# Altium schematic sheet Arduino_extension_connectors.SchDoc: Connectors
size A4; CompanyName: STMicroelectronics; Organization: Microcontrollers Division; SheetNumber: 5; SheetTotal: 8
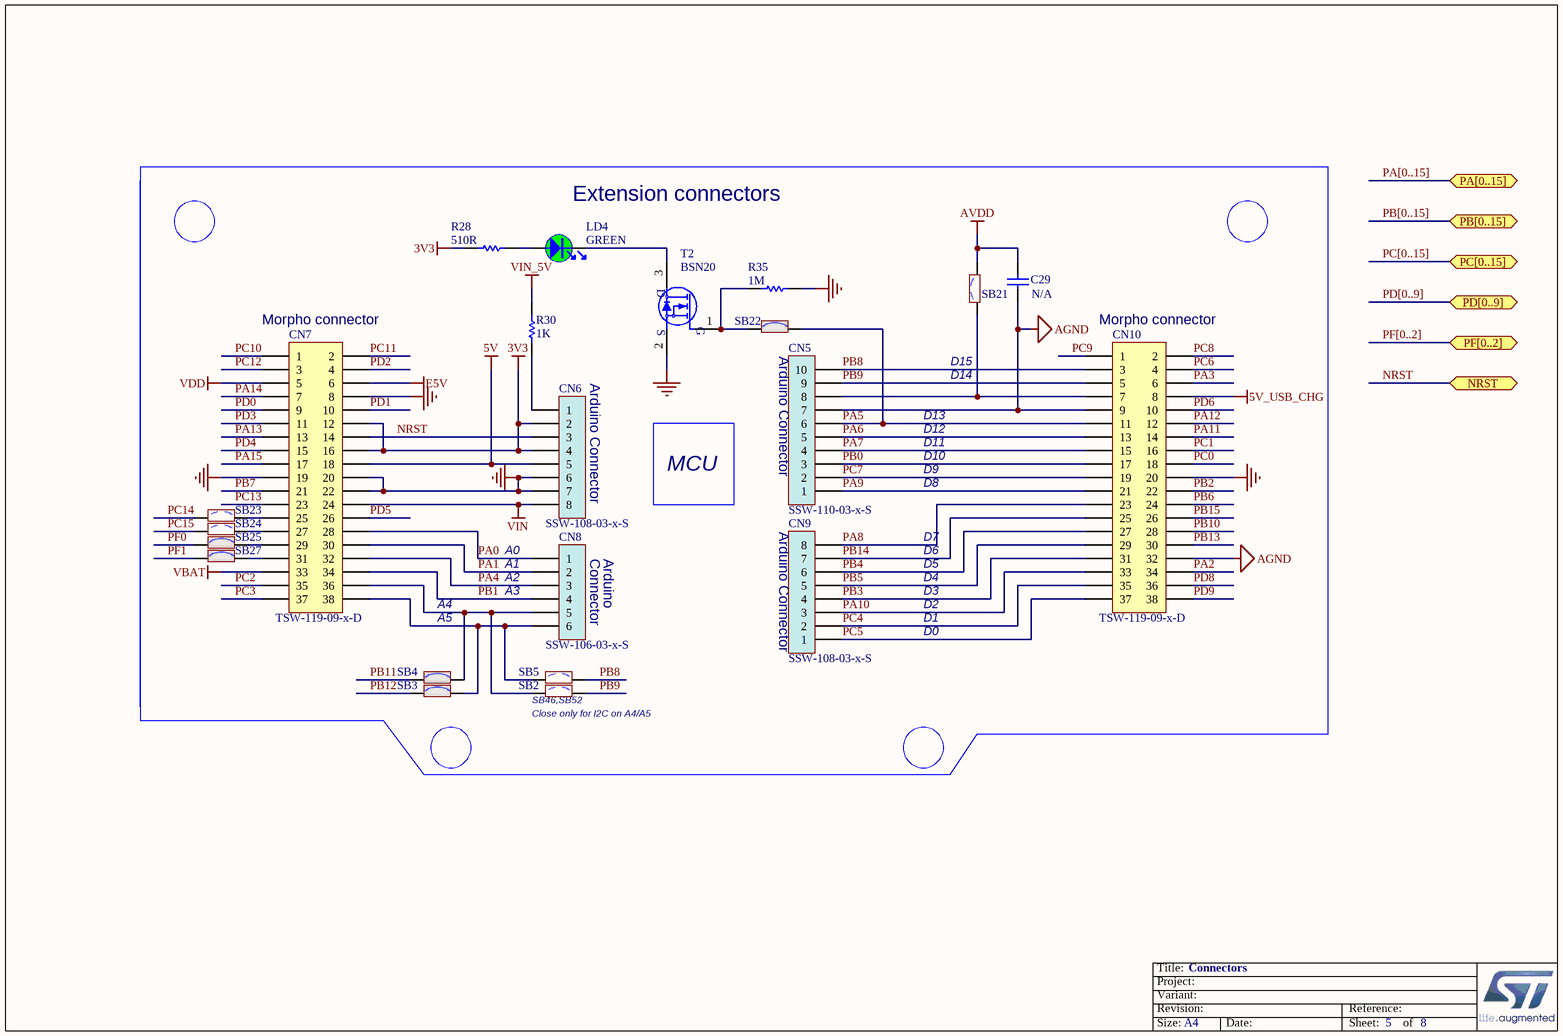
[diagram p0: Arduino_extension_connectors.SchDoc]

## Parts
C29  N/A  [C0603]
CN5  Manufacturer_Part_Number: SSW-110-03-x-S  [CON_SAMTEC_SSW-110-03-X-S]  (hidden comment: Socket 10x1)
CN6  Manufacturer_Part_Number: SSW-108-03-x-S  [CON_SAMTEC_SSW-108-03-X-S]  (hidden comment: Socket 8x1)
CN7  Manufacturer_Part_Number: TSW-119-09-x-D  [CON_SAMTEC_TSW-119-09-X-D]  (hidden comment: Header 19x2)
CN8  Manufacturer_Part_Number: SSW-106-03-x-S  [CON_SAMTEC_SSW-106-03-X-S]  (hidden comment: Socket 6x1)
CN9  Manufacturer_Part_Number: SSW-108-03-x-S  [CON_SAMTEC_SSW-108-03-X-S]  (hidden comment: Socket 8x1)
CN10  Manufacturer_Part_Number: TSW-119-09-x-D  [CON_SAMTEC_TSW-119-09-X-D]  (hidden comment: Header 19x2)
LD4  value GREEN  [LED_0603_GREEN]  (hidden comment: LED_green)
R28  value 510R  [R0603]  (hidden comment: Resistor)
R30  value 1K  [R0603]  (hidden comment: Resistor)
R35  value 1M  [R0603]  (hidden comment: Resistor)
SB2  SB_OFF  [SOLDER-BRIDGE_R0603-0R]  (value not drawn)
SB3  SB_ON  [SOLDER-BRIDGE_R0603-0R]  (value not drawn)
SB4  SB_ON  [SOLDER-BRIDGE_R0603-0R]  (value not drawn)
SB5  SB_OFF  [SOLDER-BRIDGE_R0603-0R]  (value not drawn)
SB21  SB_OFF  [SOLDER-BRIDGE_R0603-0R]  (value not drawn)
SB22  SB_ON  [SOLDER-BRIDGE_R0603-0R]  (value not drawn)
SB23  SB_OFF  [SOLDER-BRIDGE_R0603-0R]  (value not drawn)
SB24  SB_OFF  [SOLDER-BRIDGE_R0603-0R]  (value not drawn)
SB25  SB_ON  [SOLDER-BRIDGE_R0603-0R]  (value not drawn)
SB27  SB_ON  [SOLDER-BRIDGE_R0603-0R]  (value not drawn)
T2  BSN20  [MOS_SOT23]

## Ports
NRST, PA[0..15] (bidir), PB[0..15] (bidir), PC[0..15] (bidir), PD[0..9], PF[0..2] (bidir)

## Nets
3V3: CN6.2 CN6.4 CN7.12 CN7.16 R28.2
5V: CN6.5 CN7.18
5V_USB_CHG: CN10.8
AGND: C29.1 CN5.7 CN10.9 CN10.32
AVDD: C29.2 SB21.2
E5V: CN7.6
GND: CN6.6 CN6.7 CN7.8 CN7.19 CN7.20 CN7.22 CN10.20 R35.2 T2.2(S)
VBAT: CN7.33
VDD: CN7.5
VIN: CN6.8 CN7.24
VIN_5V: R30.1
NRST: CN6.3 CN7.14 ; port NRST
PA0: CN7.28 CN8.1
PA1: CN7.30 CN8.2
PA2: CN10.34
PA3: CN10.6
PA4: CN7.32 CN8.3
PA5: CN5.6 CN10.11 SB22.2
PA6: CN5.5 CN10.13
PA7: CN5.4 CN10.15
PA8: CN9.8 CN10.23
PA9: CN5.1 CN10.21
PA10: CN9.3 CN10.33
PA11: CN10.14
PA12: CN10.12
PA13: CN7.13
PA14: CN7.7
PA15: CN7.17
PB0: CN5.3 CN10.17
PB1: CN7.34 CN8.4
PB2: CN10.22
PB3: CN9.4 CN10.31
PB4: CN9.6 CN10.27
PB5: CN9.5 CN10.29
PB6: CN10.24
PB7: CN7.21
PB8: CN5.10 CN10.3 SB5.2
PB9: CN5.9 CN10.5 SB2.2
PB10: CN10.28
PB11: SB4.1
PB12: SB3.1
PB13: CN10.30
PB14: CN9.7 CN10.25
PB15: CN10.26
PC0: CN10.18
PC1: CN10.16
PC2: CN7.35
PC3: CN7.37
PC4: CN9.2 CN10.35
PC5: CN9.1 CN10.37
PC6: CN10.4
PC7: CN5.2 CN10.19
PC8: CN10.2
PC9: CN10.1
PC10: CN7.1
PC11: CN7.2
PC12: CN7.3
PC13: CN7.23
PC14: SB23.1
PC15: SB24.1
PD0: CN7.9
PD1: CN7.10
PD2: CN7.4
PD3: CN7.11
PD4: CN7.15
PD5: CN7.26
PD6: CN10.10
PD8: CN10.36
PD9: CN10.38
PF0: SB25.1
PF1: SB27.1
NetCN5_8: CN5.8 CN10.7 SB21.1
NetCN6_1: CN6.1 R30.2
NetCN7_25: CN7.25 SB23.2
NetCN7_27: CN7.27 SB24.2
NetCN7_29: CN7.29 SB25.2
NetCN7_31: CN7.31 SB27.2
NetCN7_36: CN7.36 CN8.5 SB2.1 SB4.2
NetCN7_38: CN7.38 CN8.6 SB3.2 SB5.1
NetLD4_1: LD4.1 R28.1
NetLD4_2: LD4.2 T2.3(D)
NetR35_1: R35.1 SB22.1 T2.1(G)

## Buses and harness runs
bus PA[0..15] = port PA[0..15]
bus PB[0..15] = port PB[0..15]
bus PC[0..15] = port PC[0..15]
bus PD[0..9] = port PD[0..9]
bus PF[0..2] = port PF[0..2]

## Notes on the sheet
- (near LD4) Extension connectors
- (near CN7) Morpho connector
- (near CN6) Arduino Connector
- Arduino Connector
- D14
- D15
- (near CN10) Morpho connector
- D13
- D12
- D11
- MCU
- D8
- D9
- D10
- A0
- (near CN8) A1
- (near CN8) A2
- (near CN8) Connector
- (near CN8) Arduino
- (near CN9) Arduino Connector
- D4
- D5
- D6
- D7
- A4
- A5
- (near CN8) A3
- D0
- D1
- D2
- D3
- (near SB2) Close only for I2C on A4/A5
- (near SB2) SB46,SB52
- Title:
- Project:
- Size:
- Revision:
- Variant:
- Date:
- Reference:
- Sheet:
- of

## Library data of the parts
C29 = MCD-00211: Capacitor, MLCC, 100nF, 16V, X7R, 10%, 0603, T=0,8mm; Manufacturer_Part_Number: CC0603KRX7R7BB104; Manufacturer: YAGEO; Provided_By: Subcon; Initial_Board_Reference: mb1319; Internal_Part_Number: MCD-00211; Value: 100nF; Status: Released; Part_Type: Capacitor; Package: C0603; ComponentLink1Description: Yageo_Capacitor_X7R-series.pdf; ComponentLink1URL: http://tunmcdsvn.tun.st.com/Component_Datasheet_Library/Trunk/Capacitors/Yageo_Capacitor_X7R-series.pdf; ECCN_US: n/a; ECCN_EU: n/a
CN5 = MCD-00262: Socket, 10x1, 2.54mm, VR, TH, Height 8.51mm/10mm; Manufacturer: SAMTEC; Part_Type: Connector; Provided_By: Subcon; Initial_Board_Reference: mb1319; Internal_Part_Number: MCD-00262; Value: Socket 10x1; ECCN_US: n/a; ECCN_EU: n/a; ComponentLink1Description: Samtec_SSW-SSQ-series.pdf; Status: Released; ComponentLink1URL: http://tunmcdsvn.tun.st.com/Component_Datasheet_Library/Trunk/Connectors/Samtec_SSW-SSQ-series.pdf
CN6 = MCD-00261: Socket, 8x1, 2.54mm, VR, TH, Height 8.51mm/10mm; Manufacturer: SAMTEC; Part_Type: Connector; Provided_By: Subcon; Initial_Board_Reference: mb1319; Internal_Part_Number: MCD-00261; Value: Socket 8x1; ECCN_US: n/a; ECCN_EU: n/a; ComponentLink1Description: Samtec_SSW-SSQ-series.pdf; Status: Released; ComponentLink1URL: http://tunmcdsvn.tun.st.com/Component_Datasheet_Library/Trunk/Connectors/Samtec_SSW-SSQ-series.pdf
CN7 CN10 = MCD-00213: Header, 19x2, 2,54mm, VR, TH, Height 5.84mm/10.16mm; Manufacturer: SAMTEC; Part_Type: Connector; Provided_By: Subcon; Initial_Board_Reference: mb1319; Internal_Part_Number: MCD-00213; Value: Header 19x2; ECCN_US: n/a; ECCN_EU: n/a; ComponentLink1Description: Samtec_connector_TSW-HTSW-series.pdf; Status: Released; ComponentLink1URL: http://tunmcdsvn.tun.st.com/Component_Datasheet_Library/Trunk/Connectors/Samtec_connector_TSW-HTSW-series.pdf
CN8 = MCD-00260: Socket, 6x1, 2.54mm, VR, TH, Height 8.51mm/10mm; Part_Type: Connector; Manufacturer: SAMTEC; Provided_By: Subcon; Initial_Board_Reference: mb1319; Internal_Part_Number: MCD-00260; Value: Socket 6x1; Status: Released; ComponentLink1Description: Samtec_SSW-SSQ-series.pdf; ComponentLink1URL: http://tunmcdsvn.tun.st.com/Component_Datasheet_Library/Trunk/Connectors/Samtec_SSW-SSQ-series.pdf; ECCN_US: n/a; ECCN_EU: n/a
CN9 = MCD-00261: Socket, 8x1, 2.54mm, VR, TH, Height 8.51mm/10mm; Part_Type: Connector; Manufacturer: SAMTEC; Provided_By: Subcon; Initial_Board_Reference: mb1319; Internal_Part_Number: MCD-00261; Value: Socket 8x1; Status: Released; ComponentLink1Description: Samtec_SSW-SSQ-series.pdf; ComponentLink1URL: http://tunmcdsvn.tun.st.com/Component_Datasheet_Library/Trunk/Connectors/Samtec_SSW-SSQ-series.pdf; ECCN_US: n/a; ECCN_EU: n/a
LD4 = MCD-00050: LED, Green, 0603; Part_Type: Display; Manufacturer_Part_Number: 19-213SYGC/S530-E2/TR8; Manufacturer: EVERLIGHT; ECCN_US: EAR99; ECCN_EU: NEC; Provided_By: Subcon; Initial_Board_Reference: mb1274; Internal_Part_Number: MCD-00050; Status: Released; ComponentLink1Description: Everlight_SMD-LED-GREEN_19-213SYGC-S530-XX-TR8-v3.doc.pdf; ComponentLink1URL: http://tunmcdsvn.tun.st.com/Component_Datasheet_Library/Trunk/display/Everlight_SMD-LED-GREEN_19-213SYGC-S530-XX-TR8-v3.doc.pdf
R28 = MCD-00225: Resistor,510R,0603,1%,1/10W; Manufacturer_Part_Number: RC0603FR-07510RL; Manufacturer: YAGEO; Provided_By: Subcon; Initial_Board_Reference: mb1319; Internal_Part_Number: MCD-00225; ECCN_US: n/a; ECCN_EU: n/a; ComponentLink1Description: Yageo_Resistor_RC0603-series.pdf; Status: Released; Part_Type: Resistor; Package: R0603; ComponentLink1URL: http://tunmcdsvn.tun.st.com/Component_Datasheet_Library/Trunk/Resistors/Yageo_Resistor_RC0603-series.pdf
R30 = MCD-00070: Resistor,1K,0603,1%,1/10W; Manufacturer_Part_Number: RC0603FR-071KL; Manufacturer: YAGEO; Provided_By: Subcon; Initial_Board_Reference: mb1274; Internal_Part_Number: MCD-00070; Status: Released; Part_Type: Resistor; Package: R0603; ComponentLink1Description: Yageo_Resistor_RC0603-series.pdf; ComponentLink1URL: http://tunmcdsvn.tun.st.com/Component_Datasheet_Library/Trunk/Resistors/Yageo_Resistor_RC0603-series.pdf; ECCN_US: n/a; ECCN_EU: n/a
R35 = MCD-00257: Resistor,1M,0603,1%,1/10W; Manufacturer_Part_Number: RC0603FR-071ML; Manufacturer: YAGEO; Provided_By: Subcon; Initial_Board_Reference: mb1319; Internal_Part_Number: MCD-00257; Status: Released; Part_Type: Resistor; Package: R0603; ComponentLink1Description: Yageo_Resistor_RC0603-series.pdf; ComponentLink1URL: http://tunmcdsvn.tun.st.com/Component_Datasheet_Library/Trunk/Resistors/Yageo_Resistor_RC0603-series.pdf; ECCN_US: n/a; ECCN_EU: n/a
SB2 SB5 SB21 SB23 SB24 = MCD-00072: Solder Bridge OFF; Part_Type: Mechanical; Initial_Board_Reference: mb1274; Internal_Part_Number: MCD-00072; Status: Released; ECCN_US: n/a; ECCN_EU: n/a; Provided_By: n/a
SB3 SB4 SB22 SB25 SB27 = MCD-00071: Solder Bridge ON; Part_Type: Mechanical; Provided_By: Subcon; Initial_Board_Reference: mb1274; Internal_Part_Number: MCD-00071; ECCN_US: n/a; ECCN_EU: n/a; Status: Released
T2 = MCD-00151: N-channel enhancement mode field-effect transistor; Part_Type: IC; Manufacturer: NXP; ECCN_US: EAR99; ECCN_EU: NEC; Provided_By: Subcon; Initial_Board_Reference: mb1262; Internal_Part_Number: MCD-00151; Value: BSN20; Status: Released; Manufacturer_Part_Number: BSN20; ComponentLink1Description: NXP_Transistor_BSN20BK_SOT23.pdf; ComponentLink1URL: http://tunmcdsvn.tun.st.com/Component_Datasheet_Library/Trunk/IC/NXP_Transistor_BSN20BK_SOT23.pdf